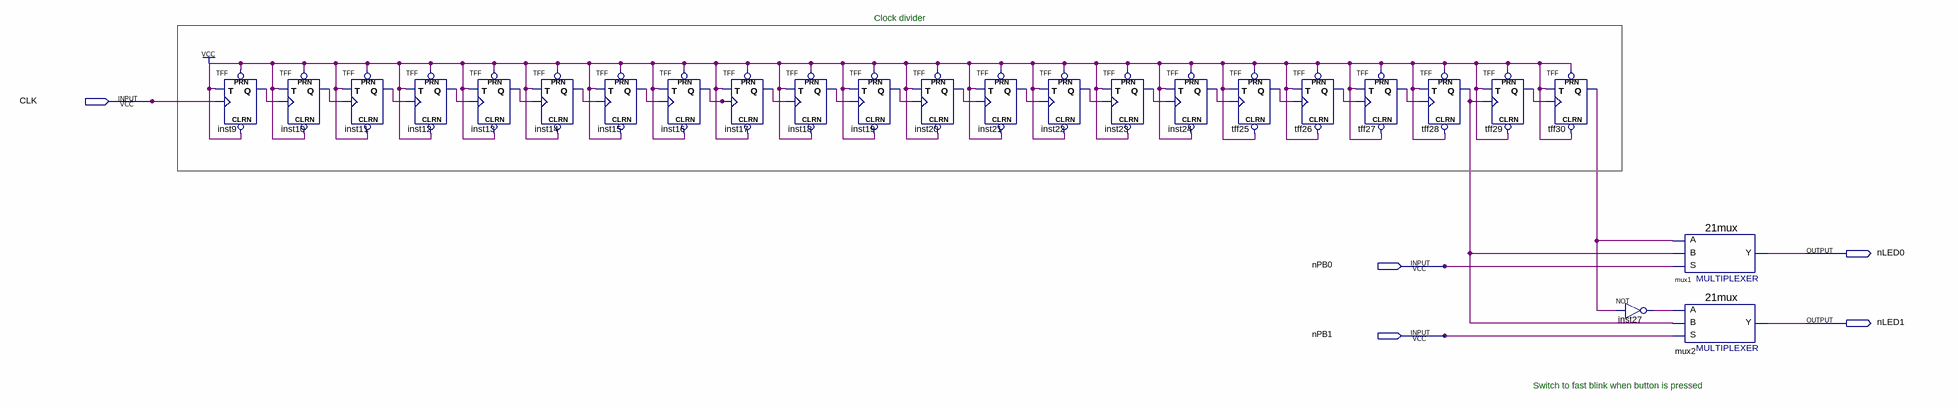
[diagram p0: schematic sheet]
// Quartus schematic BlinkSchematic.bdf as structural Verilog: 25 symbols, 5 pins
module BlinkSchematic (
  input  CLK,
  input  nPB0,
  input  nPB1,
  output nLED0,
  output nLED1
);

  wire inst9_q, inst10_q, inst11_q, inst12_q, inst13_q, inst14_q, inst15_q, inst16_q, inst17_q, inst18_q,
       inst19_q, inst20_q, inst21_q, inst22_q, inst23_q, inst24_q, inst27_out, tff25_q, tff26_q, tff27_q,
       tff28_q, tff29_q, tff30_q;

  TFF inst9 (.PRN(1'b1), .CLRN(1'b1), .T(1'b1), .CLK(CLK), .Q(inst9_q));
  TFF inst10 (.PRN(1'b1), .CLRN(1'b1), .T(1'b1), .CLK(inst9_q), .Q(inst10_q));
  TFF inst11 (.PRN(1'b1), .CLRN(1'b1), .T(1'b1), .CLK(inst10_q), .Q(inst11_q));
  TFF inst12 (.PRN(1'b1), .CLRN(1'b1), .T(1'b1), .CLK(inst11_q), .Q(inst12_q));
  TFF inst13 (.PRN(1'b1), .CLRN(1'b1), .T(1'b1), .CLK(inst12_q), .Q(inst13_q));
  TFF inst14 (.PRN(1'b1), .CLRN(1'b1), .T(1'b1), .CLK(inst13_q), .Q(inst14_q));
  TFF inst15 (.PRN(1'b1), .CLRN(1'b1), .T(1'b1), .CLK(inst14_q), .Q(inst15_q));
  TFF inst16 (.PRN(1'b1), .CLRN(1'b1), .T(1'b1), .CLK(inst15_q), .Q(inst16_q));
  TFF inst17 (.PRN(1'b1), .CLRN(1'b1), .T(1'b1), .CLK(inst16_q), .Q(inst17_q));
  TFF inst18 (.PRN(1'b1), .CLRN(1'b1), .T(1'b1), .CLK(inst17_q), .Q(inst18_q));
  TFF inst19 (.PRN(1'b1), .CLRN(1'b1), .T(1'b1), .CLK(inst18_q), .Q(inst19_q));
  TFF inst20 (.PRN(1'b1), .CLRN(1'b1), .T(1'b1), .CLK(inst19_q), .Q(inst20_q));
  TFF inst21 (.PRN(1'b1), .CLRN(1'b1), .T(1'b1), .CLK(inst20_q), .Q(inst21_q));
  TFF inst22 (.PRN(1'b1), .CLRN(1'b1), .T(1'b1), .CLK(inst21_q), .Q(inst22_q));
  TFF inst23 (.PRN(1'b1), .CLRN(1'b1), .T(1'b1), .CLK(inst22_q), .Q(inst23_q));
  TFF inst24 (.PRN(1'b1), .CLRN(1'b1), .T(1'b1), .CLK(inst23_q), .Q(inst24_q));
  TFF tff25 (.PRN(1'b1), .CLRN(1'b1), .T(1'b1), .CLK(inst24_q), .Q(tff25_q));
  TFF tff26 (.PRN(1'b1), .CLRN(1'b1), .T(1'b1), .CLK(tff25_q), .Q(tff26_q));
  TFF tff27 (.PRN(1'b1), .CLRN(1'b1), .T(1'b1), .CLK(tff26_q), .Q(tff27_q));
  TFF tff28 (.PRN(1'b1), .CLRN(1'b1), .T(1'b1), .CLK(tff27_q), .Q(tff28_q));
  TFF tff29 (.PRN(1'b1), .CLRN(1'b1), .T(1'b1), .CLK(tff28_q), .Q(tff29_q));
  TFF tff30 (.PRN(1'b1), .CLRN(1'b1), .T(1'b1), .CLK(tff29_q), .Q(tff30_q));
  not inst27 (inst27_out, tff30_q);
  \21mux  mux1 (.S(nPB0), .B(tff28_q), .A(tff30_q), .Y(nLED0));
  \21mux  mux2 (.S(nPB1), .B(tff28_q), .A(inst27_out), .Y(nLED1));

  // Notes on the sheet:
  //   Clock divider
  //   Switch to fast blink when button is pressed
endmodule
